# EAGLE schematic Design (EAGLE 9.4.2)
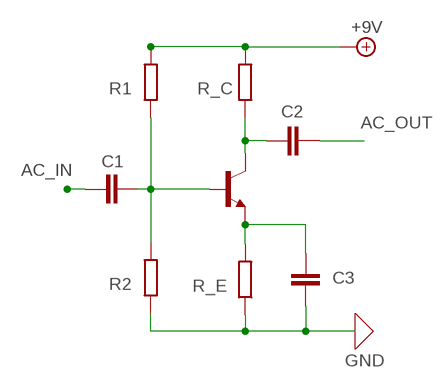
[diagram p0: schematic, sheet 1]

## Parts
C1  10u  C2.5/2  [C2.5-2]
C2  10n  C2.5/2  [C2.5-2]
C3  100u  C2.5/2  [C2.5-2]
R1  52k  R  (no package)
R2  10k  R  (no package)
R_C  6k  R  (no package)
R_E  1k  R  (no package)
T1  BC547  [TO92]

## Nets
+9V: R1.2 R_C.2
AC_IN: C1.1
AC_OUT: C2.2
GND: C3.2 R2.1 R_E.1
N$1: C2.1 R_C.1 T1.3(C)
N$2: C3.1 R_E.2 T1.1(E)
N$4: C1.2 R1.1 R2.2 T1.2(B)

## Library data of the parts
C1-C3 = capacitor-wima:C: CAPACITOR naming: grid - package width
R1 R2 R_C R_E = ngspice-simulation:R: RESISTOR
T1 = transistor:BC547: NPN TRANSISTOR